# EAGLE schematic pid motor DC (EAGLE 9.6.1)
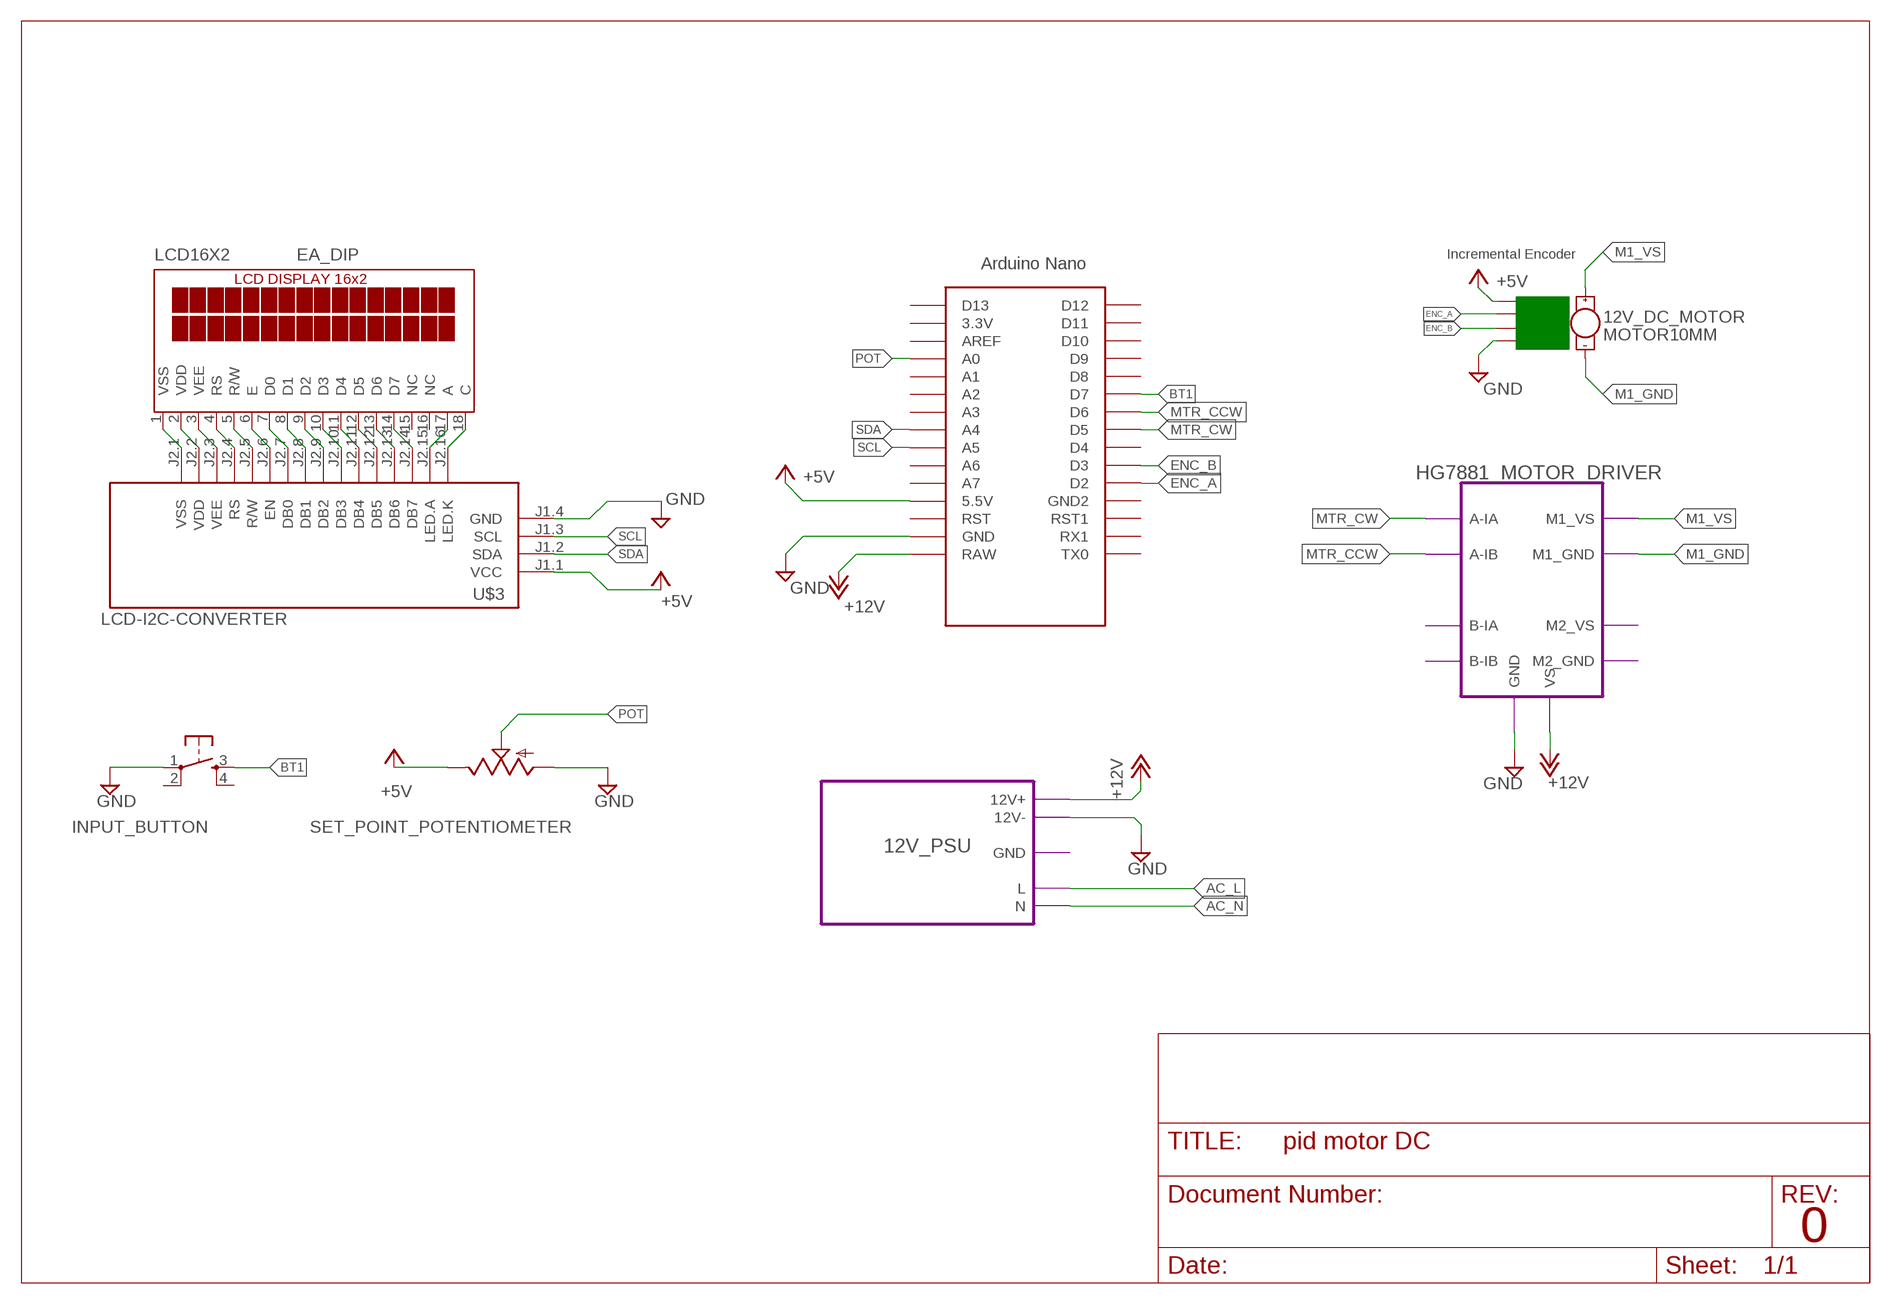
[diagram p0: schematic, sheet 1]

## Parts
12V_DC_MOTOR  MOTOR10MM  [VIBE-MOTOR-10MM]
INPUT_BUTTON  MOMENTARY-SWITCH-SPST-2-SMD-4.6X2.8MM  [TACTILE_SWITCH_SMD_4.6X2.8MM]
LCD16X2  EA_DIP  [EA_DIP]
SET_POINT_POTENTIOMETER  TRIM_US-B25U  [B25U]
U$2  NANO  [NANO]
U$3  LCD-I2C-CONVERTER  [LCD-I2C-CONVERTER]

## Module instances
HG7881_MOTOR_DRIVER = HG7661
12V_PSU = 12V_PSU

## Nets
+5V: SET_POINT_POTENTIOMETER.E U$2.5V(5.5V) U$3.J1.1(VCC)
+12V: U$2.RAW ; port HG7881_MOTOR_DRIVER.VS 12V_PSU.12V+
AC_L: port 12V_PSU.L
AC_N: port 12V_PSU.N
BT1: INPUT_BUTTON.3 U$2.D7
ENC_A: U$2.D2
ENC_B: U$2.D3
GND: INPUT_BUTTON.1 SET_POINT_POTENTIOMETER.A U$2.GND U$3.J1.4(GND) ; port HG7881_MOTOR_DRIVER.GND 12V_PSU.12V-
M1_GND: 12V_DC_MOTOR.- ; port HG7881_MOTOR_DRIVER.M1_GND
M1_VS: 12V_DC_MOTOR.+ ; port HG7881_MOTOR_DRIVER.M1_VS
MTR_CCW: U$2.D6 ; port HG7881_MOTOR_DRIVER.A-IB
MTR_CW: U$2.D5 ; port HG7881_MOTOR_DRIVER.A-IA
N$2: LCD16X2.1(VSS) U$3.J2.1(VSS)
N$3: LCD16X2.2(VDD) U$3.J2.2(VDD)
N$4: LCD16X2.3(VEE) U$3.J2.3(VEE)
N$8: LCD16X2.4(RS) U$3.J2.4(RS)
N$9: LCD16X2.5(R/W) U$3.J2.5(R/W)
N$10: LCD16X2.6(E) U$3.J2.6(EN)
N$11: LCD16X2.7(D0) U$3.J2.7(DB0)
N$12: LCD16X2.8(D1) U$3.J2.8(DB1)
N$13: LCD16X2.9(D2) U$3.J2.9(DB2)
N$14: LCD16X2.10(D3) U$3.J2.10(DB3)
N$15: LCD16X2.11(D4) U$3.J2.11(DB4)
N$16: LCD16X2.12(D5) U$3.J2.12(DB5)
N$17: LCD16X2.13(D6) U$3.J2.13(DB6)
N$18: LCD16X2.14(D7) U$3.J2.14(DB7)
N$19: LCD16X2.17(A) U$3.J2.15(LED.A)
N$20: LCD16X2.18(C) U$3.J2.16(LED.K)
POT: SET_POINT_POTENTIOMETER.S U$2.A0
SCL: U$2.A5 U$3.J1.3(SCL)
SDA: U$2.A4 U$3.J1.2(SDA)
Unconnected: INPUT_BUTTON.2 INPUT_BUTTON.4 LCD16X2.15(NC) LCD16X2.16(NC) U$2.3.3V U$2.A1 U$2.A2 U$2.A3 U$2.A6 U$2.A7 U$2.AREF U$2.D4 U$2.D8 U$2.D9 U$2.D10 U$2.D11 U$2.D12 U$2.D13 U$2.GND1(GND2) U$2.ICSP1 U$2.ICSP2 U$2.ICSP3 U$2.ICSP4 U$2.ICSP5 U$2.ICSP6 U$2.RST U$2.RST1 U$2.RX1 U$2.TX0

## Notes on the sheet
- Incremental Encoder
- 0

## Library data of the parts
12V_DC_MOTOR = SparkFun-Electromechanical:MOTOR: Motor (Single-Phase) Two-terminal, single-phase motors. SparkFun Products Vibration Motor <https://www.sparkfun.com/products/8449> (ROB-08449) Physical dimension and wire connections for this powerful vibration motor. Motor has a self adhesive backing.; PROD_ID: COMP-08572; SF_SKU: ROB-08449
INPUT_BUTTON = SparkFun-Switches:MOMENTARY-SWITCH-SPST-2: Momentary Switch (Pushbutton) - SPST - Two Circuits Normally-open (NO) SPST momentary switches (buttons, pushbuttons). Schematic symbol includes two switch circuits. Variants SMD-4.6MMX2.8MM - 4.60mm x 2.80mm Tactile Momentary Button Switch - Used on SparkFun SAMD21 Mini Breakout <https://www.sparkfun.com/products/13664> SMD-5.2MM - Mini Pushbutton Switch - SMD <https://www.sparkfun.com/products/8720> - Used on Arduino Pro Mini <https://www.sparkfun.com/products/11114>; PROD_ID: SWCH-13065
LCD16X2 = display-lcd:EA_DIP: LCD-MODUL 2x16 - 6,68mm, INKL. KONTROLLER HD44780 Source: Data sheet <http://www.lcd-module.de/pdf/doma/dip162-d.pdf>
SET_POINT_POTENTIOMETER = pot:TRIM_US-: POTENTIOMETER
U$2 = Arduino-clone:NANO: Arduino Nano
U$3 = diy-modules:LCD-I2C-CONVERTER: I2C Bus to 4-Bit Parallel LCD Interface with LED backlight driver

## Module INCREMENTAL_ENC
Ports: 

### Library data of the parts

## Module HG7661
Ports: M1_VS(io) M1_GND(io) M2_VS(io) M2_GND(io) A-IA(io) A-IB(io) B-IA(io) B-IB(io) VS(io) GND(io)

### Library data of the parts

## Module 12V_PSU
Ports: 12V+(io) 12V-(io) L(io) N(io) GND(io)

### Library data of the parts